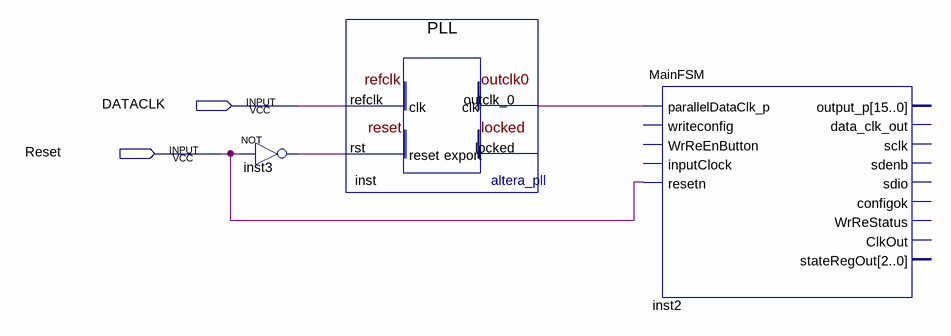
[diagram p0: schematic sheet]
// Quartus schematic Diagram.bdf as structural Verilog: 3 symbols, 2 pins
module Diagram (
  input  DATACLK,
  input  Reset
);

  wire inst3_out, inst_outclk_0;

  not inst3 (inst3_out, Reset);
  PLL inst (.refclk(DATACLK), .rst(inst3_out), .outclk_0(inst_outclk_0));  // open: locked
  MainFSM inst2 (
    .parallelDataClk_p(inst_outclk_0), .resetn(Reset));  // open: writeconfig, WrReEnButton, inputClock, output_p, data_clk_out, WrReStatus, ClkOut, stateRegOut, sclk, sdenb, sdio, configok
endmodule
